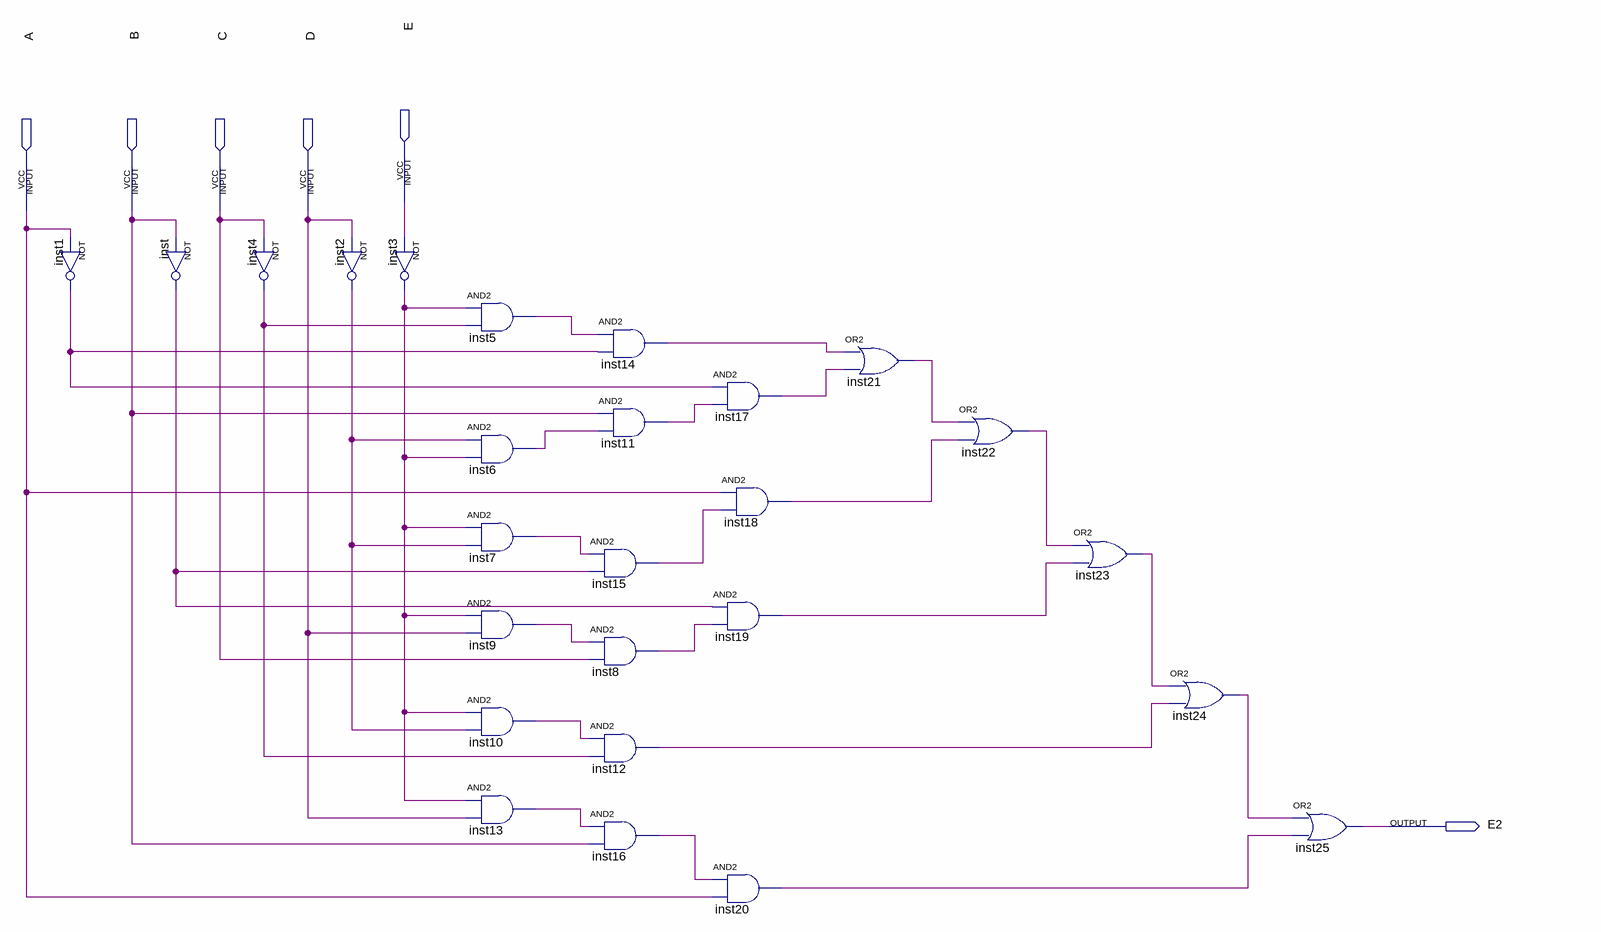
[diagram p0: schematic sheet]
// Quartus schematic led-E2.bdf as structural Verilog: 26 symbols, 6 pins
module \led-E2  (
  input  E,
  input  A,
  input  B,
  input  C,
  input  D,
  output E2
);

  wire inst1_out, inst2_out, inst3_out, inst4_out, inst5_out, inst6_out, inst7_out, inst8_out, inst9_out,
       inst10_out, inst11_out, inst12_out, inst13_out, inst14_out, inst15_out, inst16_out, inst17_out,
       inst18_out, inst19_out, inst20_out, inst21_out, inst22_out, inst23_out, inst24_out, inst_out;

  not inst1 (inst1_out, A);
  not inst (inst_out, B);
  not inst4 (inst4_out, C);
  not inst2 (inst2_out, D);
  not inst3 (inst3_out, E);
  and inst5 (inst5_out, inst3_out, inst4_out);
  and inst6 (inst6_out, inst2_out, inst3_out);
  and inst7 (inst7_out, inst3_out, inst2_out);
  and inst9 (inst9_out, inst3_out, D);
  and inst10 (inst10_out, inst3_out, inst2_out);
  and inst13 (inst13_out, inst3_out, D);
  and inst14 (inst14_out, inst5_out, inst1_out);
  and inst11 (inst11_out, B, inst6_out);
  and inst15 (inst15_out, inst7_out, inst_out);
  and inst8 (inst8_out, inst9_out, C);
  and inst12 (inst12_out, inst10_out, inst4_out);
  and inst16 (inst16_out, inst13_out, B);
  and inst17 (inst17_out, inst1_out, inst11_out);
  and inst18 (inst18_out, A, inst15_out);
  and inst19 (inst19_out, inst_out, inst8_out);
  and inst20 (inst20_out, inst16_out, A);
  or inst21 (inst21_out, inst14_out, inst17_out);
  or inst22 (inst22_out, inst21_out, inst18_out);
  or inst23 (inst23_out, inst22_out, inst19_out);
  or inst24 (inst24_out, inst23_out, inst12_out);
  or inst25 (E2, inst24_out, inst20_out);
endmodule
